# EasyEDA Pro project ProProject_Kame Quadrapot_2024-12-26.epro, schematic Upper_ESP32
Create Date: 2024-12-10; Page Name: P1; Project Name: Kame Quadrapot; Schematic Name: Upper_ESP32; Update Date: 2024-12-20; Company: Personal; Drawn: San Thit Aung; Page Size: A3; Part Number: PCB002; Reviewed: San Thit Aung; Version: V0.1
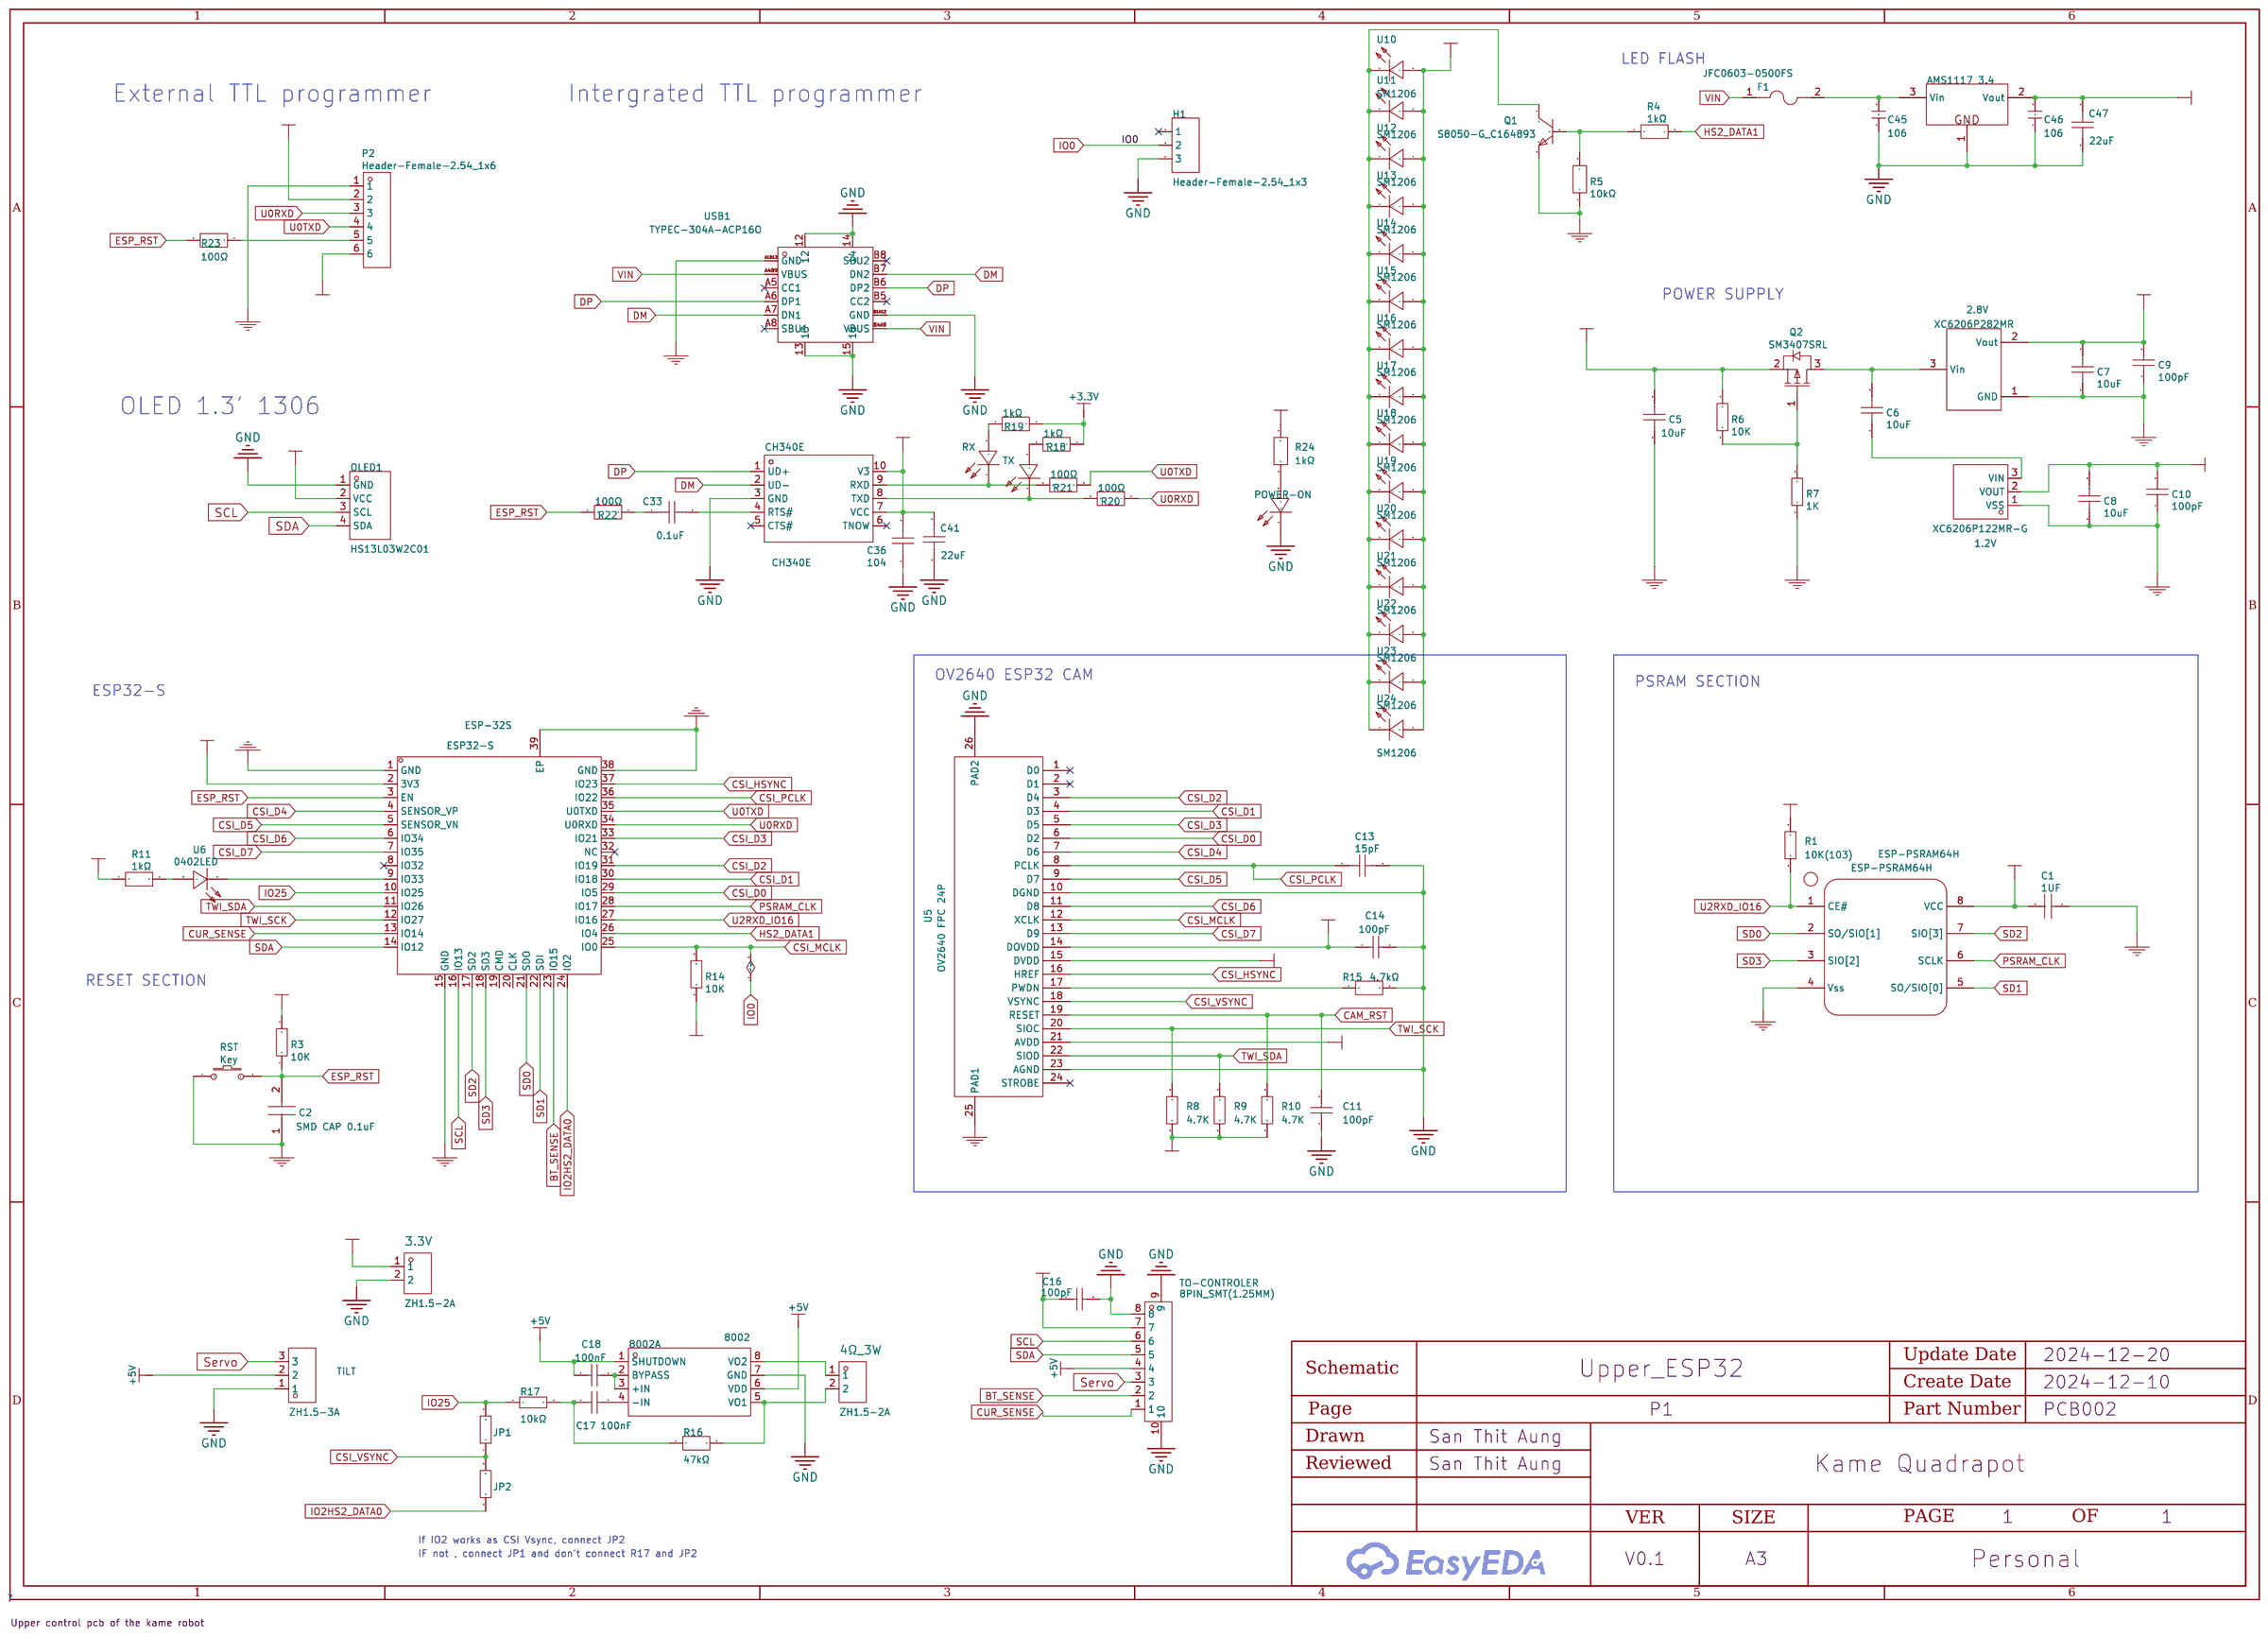
[diagram p0: schematic sheet]

## Parts
1.2V  XC6206P122MR-G  [SOT-23-3_L2.9-W1.6-P1.90-LS2.8-BR]
2.8V  XC6206P282MR  [SOT-23-3_L2.9-W1.6-P1.90-LS2.8-BR]
3.3V  ZH1.5-2A  [CONN-TH_ZH-1.5-2A]
4Ω_3W  ZH1.5-2A  [CONN-TH_ZH-1.5-2A]
8002A  8002  [SOP-8_L4.9-W3.9-P1.27-LS6.0-BL]
AMS1117 3.4  AMS1117-3.3  [TO-252-3_L6.6-W6.1-P4.58-LS10.1-BR]
C1  1UF  [0402]
C2  SMD CAP 0.1uF  [CAPC2012X94N]
C5  10uF  [C0805]
C6  10uF  [C0805]
C7  10uF  [C0805]
C8  10uF  [C0805]
C9  100pF  [C0402]
C10  100pF  [C0402]
C11  100pF  [C0402]
C13  15pF  [C0402]
C14  100pF  [C0402]
C16  100pF  [C0402]
C17  100nF  [C0603]
C18  100nF  [C0603]
C33  0.1uF  [C0603]
C36  104  [C0603]
C41  22uF  [C1206]
C45  106  [C0805]
C46  106  [C0805]
C47  22uF  [C1206]
CH340E  CH340E  [MSOP-10_L3.0-W3.0-P0.50-LS5.0-BL]
ESP-32S  ESP32-S  [WIRELM-SMD_ESP32-S-NO_CMD_CLK]
ESP-PSRAM64H  ESP-PSRAM64H  [SOP8_150MIL_JX]
F1  JFC0603-0500FS  [F0603]
H1  Header-Female-2.54_1x3  [HDR-3X1/2.54]
JP1  10kΩ  [R0603]
JP2  10kΩ  [R0603]
OLED1  HS13L03W2C01  [1.3'' 4pin oled SH1106]
P2  Header-Female-2.54_1x6  [HDR-TH_6P-P2.54-V-F]
POWER-ON  Green  [LED0603-RD_GREEN]
Q1  S8050-G_C164893  [SOT-23-3_L2.9-W1.3-P1.90-LS2.4-BR]
Q2  SM3407SRL  [SOT-23-3_L2.9-W1.3-P1.90-LS2.4-BR]
R1  10K(103)  [0603]
R3  10K  [0201]
R4  1kΩ  [R0402]
R5  10kΩ  [R0402]
R6  10K  [R0402]
R7  1K  [R0603]
R8  4.7K  [R0402]
R9  4.7K  [R0402]
R10  4.7K  [R0402]
R11  1kΩ  [R0402]
R14  10K  [R0402]
R15  4.7kΩ  [R0402]
R16  47kΩ  [R0603]
R17  10kΩ  [R0603]
R18  1kΩ  [R0603]
R19  1kΩ  [R0603]
R20  100Ω  [R0603]
R21  100Ω  [R0603]
R22  100Ω  [R0603]
R23  100Ω  [R0603]
R24  1kΩ  [R0603]
RST  Key  [KEY]
RX  Green  [LED0603-RD_GREEN]
TILT  ZH1.5-3A  [CONN-TH_ZH1.5-3A_C2829733]
TO-CONTROLER  8PIN_SMT(1.25MM)  [CONN-SMD_8PIN_SMT-P1.25]
TX  LedGreen_0603  [LED0603-RD_GREEN]
U5  OV2640 FPC 24P  [OV2640 FPC 24P]
U6  0402LED  [LED0402-RD]
U10  SM1206  [LED1206-RD]
U11  SM1206  [LED1206-RD]
U12  SM1206  [LED1206-RD]
U13  SM1206  [LED1206-RD]
U14  SM1206  [LED1206-RD]
U15  SM1206  [LED1206-RD]
U16  SM1206  [LED1206-RD]
U17  SM1206  [LED1206-RD]
U18  SM1206  [LED1206-RD]
U19  SM1206  [LED1206-RD]
U20  SM1206  [LED1206-RD]
U21  SM1206  [LED1206-RD]
U22  SM1206  [LED1206-RD]
U23  SM1206  [LED1206-RD]
U24  SM1206  [LED1206-RD]
USB1  TYPEC-304A-ACP16O  [USB-SMD_TYPEC-304A-ACP16O]

## Library data of the parts
1.2V = XC6206P122MR-G: Supplier: LCSC; Supplier Part: C424699; Manufacturer: Torex Semicon; JLCPCB Part Class: Extend; JLCPCB SMD: Yes; SMT Type: Extend; spicePre: U
2.8V = XC6206P282MR: Supplier: LCSC; Manufacturer: TOREX; image: //image.lceda.cn/szlcsc/C14255.jpg; Supplier Part: C14255; JLCPCB Part Class: Extend; JLCPCB SMD: Yes; SMT Type: Extend; spicePre: U
3.3V 4Ω_3W = ZH1.5-2A_C722910: Pins Structure:1x2P Pitch:1.5mm Mounting Style:Straight Reference Series:ZH Number of Pins:2P Number of Rows:1 Number of PINs Per Row:2 Row Spacing:- Current Rating (Max):1A Operating Temperature Range:-25℃~+85℃ Operating Temperature Range:-25℃~+85℃; LCSC Part Name: 1x2P 间距:1.5mm 直插 系列:ZH; Supplier Part: C722910; Manufacturer: CAX(创都); Supplier Footprint: 插件,P=1.5mm; JLCPCB Part Class: Extended Part; Datasheet: https://atta.szlcsc.com/upload/public/pdf/source/20200902/C722910_3A606E9023366FB4B71ACF538A145687.pdf; Supplier: LCSC; Pins Structure: 1x2P; Pitch: 1.5mm; Mounting Style: Straight; Reference Series: ZH; Number of Pins: 2P; Number of Rows: 1; Number of PINs Per Row: 2; Current Rating (Max): 1A; Operating Temperature Range: -25℃~+85℃
8002A = 8002: LCSC Part Name: Aip8002; Supplier Part: C5139016; Manufacturer: I-CORE(中微爱芯); Supplier Footprint: SOP-8; JLCPCB Part Class: Extended Part; Datasheet: https://atta.szlcsc.com/upload/public/pdf/source/20220816/03501F7F7652C9F9E3FDDA0D1837E9DD.pdf; Supplier: LCSC
AMS1117 3.4 = AMS1117-5.0: ------ѹоƬ; BOM____: --ѹоƬ; __Ȩ____: Դ----; ѧϰ__Դ: www.ooocke.com; Origin Footprint 2: SOT223_L; Origin Footprint 3: SOT223_M; Origin Footprint 4: SOT223_N; Origin Footprint 5: SOT89_N; Origin Footprint 6: SOT89_M; Origin Footprint 1: SOT89_L; Design Item ID: AMS1117; Library Name: 1.3   - --Դ--оƬ
C1 = 1UF: Partnumber: CL05A105MP5NNNC; Manufacturer: Samsung Electro-Mechanics; Comment: =Value; spicePre: C
C2 = SMD CAP 0.1uF: spicePre: C
C5-C8 = 10uF: Supplier: LCSC; Manufacturer: FH; Manufacturer Part: 0805F106M160NT; Supplier Part: C90545; JLCPCB Part Class: Extend; JLCPCB SMD: Yes; SMT Type: Extend; spicePre: C
C9-C11 C14 C16 = 100pF: Supplier: LCSC; Manufacturer: FH; Manufacturer Part: 0402CG101J500NT; Supplier Part: C1546; JLCPCB Part Class: Basic; JLCPCB SMD: Yes; SMT Type: Basic; spicePre: C
C13 = 15pF: Supplier: LCSC; Supplier Part: C3903890; Manufacturer: TDK; Manufacturer Part: CGJ2B2C0G1H150J050BA; spicePre: C
C17 C18 = CT41G-0603-2X1-50V-0.1μF-K(N): Capacitance: Tolerance:±10% Tolerance:±10% Voltage Rated: Temperature Coefficient:; LCSC Part Name: 100nF ±10% 50V; Supplier Part: C125205; Manufacturer: TORCH(火炬); Supplier Footprint: 0603; JLCPCB Part Class: Extended Part; Datasheet: https://atta.szlcsc.com/upload/public/pdf/source/20171225/C150708_15141883600121203188.pdf; Supplier: LCSC; Tolerance: ±10%
C33 C36 = 1u: Manufacturer Part: ?
C41 C47 = 22uF: Supplier: LCSC; Supplier Part: C141046; Manufacturer: KEMET; Manufacturer Part: C1210C106M4PAC7800; JLCPCB Part Class: Extended Part
C45 C46 = 106: -޼-----Ƭ----; BOM____: -޼-----Ƭ----; __Ȩ____: Դ----; ѧϰ__Դ: www.ooocke.com; Origin Footprint 2: C 0201_L; Origin Footprint 3: C 0402_L; Origin Footprint 4: C 0603_L; Origin Footprint 5: C 1206_L; Origin Footprint 6: C 1210_L; Origin Footprint 7: C 1808_L; Origin Footprint 8: C 1812_L; Origin Footprint 9: C 1825_L; Origin Footprint 10: C 2225_L; Origin Footprint 11: C 0201_M; Origin Footprint 12: C 0402_M; Origin Footprint 13: C 0603_M; Origin Footprint 14: C 0805_M; Origin Footprint 15: C 1206_M; Origin Footprint 16: C 1210_M; Origin Footprint 17: C 1808_M; Origin Footprint 18: C 1812_M; Origin Footprint 19: C 1825_M; Origin Footprint 20: C 2225_M; Origin Footprint 1: C 0805_L; Design Item ID: C; Library Name: 3.1   - -------------
CH340E = CH340E: Applications Function:Transceiver Protocol: Supply Voltage:3.3V；5V Supply Voltage:3.3V；5V Data Rate:2Mbps; LCSC Part Name: USB转串口芯片CH340; Supplier Part: C99652; Manufacturer: WCH(南京沁恒); Supplier Footprint: MSOP-10; JLCPCB Part Class: Extended Part; Datasheet: https://atta.szlcsc.com/upload/public/pdf/source/20240313/4FD4567B6A986AE079C4960D6CEBDDB5.pdf; Supplier: LCSC; Applications Function: Transceiver; Supply Voltage: 3.3V；5V; Data Rate: 2Mbps
ESP-32S = ESP32-S: Supplier: LCSC; Supplier Part: C277944; Manufacturer: Ai-Thinker; spicePre: U
ESP-PSRAM64H = ESP-PSRAM64H: Manufacturer: Espressif; Manufacturer Part: PSRAM64H; link: https://www.espressif.com/sites/default/files/documentation/esp-psram64_esp-psram64h_datasheet_en.pdf; spicePre: U
F1 = JFC0603-0500FS: Type:SMD Fuse Current Rating:500mA Voltage Rating  (AC):32V Voltage Rating (DC):32V Operating Temperature:-55℃~+125℃ Operating Temperature:-55℃~+125℃ Breaking Capacity:50A; LCSC Part Name: 贴片式保险丝; Supplier Part: C136327; Manufacturer: JDTfuse(集电通); Supplier Footprint: 0603; JLCPCB Part Class: Extended Part; Datasheet: https://atta.szlcsc.com/upload/public/pdf/source/20230515/811EFBDB78EA9425F730277E38B1B60D.pdf; Supplier: LCSC; Type: SMD Fuse; Current Rating: 500mA; Voltage Rating  (AC): 32V; Voltage Rating (DC): 32V; Operating Temperature: -55℃~+125℃; Breaking Capacity: 50A
H1 = Header-Female-2.54_1x3: Supplier Part: C50950; Supplier: LCSC; Manufacturer: BOOMELE; Manufacturer Part: 2.54mm 1*3p Female header
JP1 JP2 R17 = RMC060310KFN: Resistance: Tolerance:±1% Tolerance:±1% Power(Watts):; LCSC Part Name: 10kΩ ±1% 100mW; Supplier Part: C269701; Manufacturer: Tyohm(幸亚电阻); Supplier Footprint: 0603; JLCPCB Part Class: Extended Part; Datasheet: https://atta.szlcsc.com/upload/public/pdf/source/20190115/C325956_D27151D492FFB3C9AB4A6F14FE01F30A.pdf; Supplier: LCSC; Tolerance: ±1%
OLED1 = HS13L03W2C01: Main Control Chip:SH1106 Interface Type:I2C Size:1.3 Operating Temperature:-40℃~+70℃ Operating Temperature:-40℃~+70℃; LCSC Part Name: 1.3'1.3寸 128*64 OLED显示屏 I2C通讯 SH1106 白光; Supplier Part: C7465997; Manufacturer: HS(汉昇); JLCPCB Part Class: Extended Part; Datasheet: https://atta.szlcsc.com/upload/public/pdf/source/20230720/8731A47396DED074CDCD72E9ACEFB46F.pdf; Supplier: LCSC; Main Control Chip: SH1106; Interface Type: I2C; Size: 1.3; Operating Temperature: -40℃~+70℃
P2 = Header-Female-2.54_1x6: Supplier: LCSC; Manufacturer: BOOMELE(博穆精密); Manufacturer Part: 2.54-1*6P母; Supplier Part: C40877; JLCPCB Part Class: Extended Part; spicePre: P
POWER-ON RX TX = LedGreen_0603: Supplier: Mouser
Q1 = S8050-G_C164893: Supplier: LCSC; Supplier Part: C164893; Manufacturer: Changjiang Electronics Tech (CJ); Manufacturer Part: S8050-G; JLCPCB Part Class: Extend; JLCPCB SMD: Yes; SMT Type: Extend; spicePre: Q
Q2 = SM3407SRL: Supplier: LCSC; Supplier Part: C235545; Manufacturer: SPS; JLCPCB Part Class: Extend; JLCPCB SMD: Yes; SMT Type: Extend; spicePre: Q
R1 = 10K(103): Supplier Part: C99198; Supplier: LCSC; Manufacturer: YAGEO; Manufacturer Part: RC0603JR-0710KL; spicePre: R
R3 = 10K: Supplier: Digi-Key; Manufacturer: YAGEO; Manufacturer Part: RC0201JR-0710KL; Supplier Part: 311-10KNCT-ND; sourceId: Yke82kCUc; spicePre: R
R4 R11 = 1kΩ: Supplier: LCSC; Supplier Part: C2961360; Manufacturer: FH(风华); Manufacturer Part: TC02G1001FT; JLCPCB Part Class: Extended Part; spicePre: U
R5 = 10kΩ: Supplier: LCSC; Supplier Part: C5119777; Manufacturer: RALEC(旺诠); Manufacturer Part: RAT021002FTH; JLCPCB Part Class: Extended Part; spicePre: U
R6 R14 = 10K: Supplier: LCSC; Manufacturer: UniOhm; Manufacturer Part: 0402WGF1002TCE; Supplier Part: C25744; JLCPCB Part Class: Basic; JLCPCB SMD: Yes; SMT Type: Basic; spicePre: R
R7 = 1K: Supplier: LCSC; Manufacturer: UniOhm; Manufacturer Part: 0603WAF1001T5E; Supplier Part: C21190; JLCPCB Part Class: Basic; JLCPCB SMD: Yes; SMT Type: Basic; spicePre: R
R8-R10 = 4.7K: Supplier: LCSC; Manufacturer: UniOhm; Manufacturer Part: 0402WGF4701TCE; Supplier Part: C25900; JLCPCB Part Class: Basic; JLCPCB SMD: Yes; SMT Type: Basic; spicePre: R
R15 = 4.7kΩ: Supplier: LCSC; Supplier Part: C2906941; Manufacturer: FOJAN(富捷); Manufacturer Part: FRC0402J472 TS; JLCPCB Part Class: Extended Part; spicePre: U
R16 R18-R24 = SCR0603F8R06: Type:Thick Film Resistors Resistance: Tolerance:±1% Tolerance:±1% Power(Watts): Overload Voltage (Max): Operating Temperature Range:-55℃~+155℃ Operating Temperature Range:-55℃~+155℃; LCSC Part Name: 厚膜电阻 8.06Ω ±1% 100mW; Supplier Part: C3016465; Manufacturer: VO(翔胜); Supplier Footprint: 0603; JLCPCB Part Class: Extended Part; Datasheet: https://atta.szlcsc.com/upload/public/pdf/source/20220513/247AF9639BA21CF93567DC289CCC6A22.pdf; Supplier: LCSC; Type: Thick Film Resistors; Tolerance: ±1%; Operating Temperature Range: -55℃~+155℃
RST = Key: spicePre: U
TILT = ZH1.5-3A: Pins Structure:1x3P Pitch:1.5mm Mounting Style:Direct Insert Reference Series:ZH Number of Pins:3P Number of Rows:1 Number of PINs Per Row:3 Current Rating (Max):1A Contact Material:Brass Contact Plating:Tin Operating Temperature Range:-25℃~+85℃ Operating; LCSC Part Name: 1x3P 间距:1.5mm 直插 系列:ZH; Supplier Part: C2829733; Manufacturer: FG(富港); Supplier Footprint: 插件,P=1.5mm; JLCPCB Part Class: Extended Part; Datasheet: https://atta.szlcsc.com/upload/public/pdf/source/20210425/C2829732_F26530E371F6662D5811C22FF273BDDC.pdf; Supplier: LCSC; Pins Structure: 1x3P; Pitch: 1.5mm; Mounting Style: Direct Insert; Reference Series: ZH; Number of Pins: 3P; Number of Rows: 1; Number of PINs Per Row: 3; Current Rating (Max): 1A; Contact Material: Brass; Contact Plating: Tin; Operating Temperature Range: -25℃~+85℃; Rated Voltage (Max): 100V
TO-CONTROLER = 8PIN_SMT(1.25MM): Supplier Part: C9900003224; Supplier Footprint: CON-SMD-8PIN-P1.25mm; JLCPCB Part Class: Extended Part; Supplier: LCSC
U5 = OV2640 FPC 24P: Supplier: LCSC; spicePre: U
U6 = 0402LED: Supplier: LCSC; Supplier Part: C9900023982; Manufacturer: null; JLCPCB Part Class: Extended Part; spicePre: U
U10-U24 = SM1206: Supplier Part: C9900019107; Supplier Footprint: LED-SMD1206; JLCPCB Part Class: Extended Part; Supplier: LCSC
USB1 = TYPEC-304A-ACP16O: Supplier: LCSC; Supplier Part: C2909610; Manufacturer: XUNPU(讯普); JLCPCB Part Class: Extended Part

## Nets
+3.3V: 3.3V.1 AMS1117 3.4.2(Vout) C1.1 C5.2 C14.1 C16.1 C36.2 C41.2 C46.2 C47.2 CH340E.7(VCC) CH340E.10(V3) ESP-32S.2(3V3) ESP-PSRAM64H.8(VCC) OLED1.2(VCC) P2.6 Q2.2(S) R1.2 R3.2 R6.2 R8.1 R9.1 R10.1 R11.1 R14.1 R18.1 R19.1 R24.1 TO-CONTROLER.7 U5.14(DOVDD) U10.2(+) U11.2(+) U12.2(+) U13.2(+) U14.2(+) U15.2(+) U16.2(+) U17.2(+) U18.2(+) U19.2(+) U20.2(+) U21.2(+) U22.2(+) U23.2(+) U24.2(+)
+5V: 8002A.1(SHUTDOWN) 8002A.6(VDD) C18.1 P2.2 TILT.2 TO-CONTROLER.4
GND: 1.2V.1(VSS) 2.8V.1(GND) 3.3V.2 8002A.7(GND) AMS1117 3.4.1(GND) C1.2 C2.1 C5.1 C7.1 C8.1 C9.1 C10.1 C11.1 C13.2 C14.2 C16.2 C36.1 C41.1 C45.1 C46.1 C47.1 CH340E.3(GND) ESP-32S.1(GND) ESP-32S.15(GND) ESP-32S.38(GND) ESP-32S.39(EP) ESP-PSRAM64H.4(Vss) H1.3 OLED1.1(GND) P2.1 POWER-ON.1(K) Q1.2(E) R5.1 R7.1 R15.2 RST.1 TILT.1 TO-CONTROLER.8 TO-CONTROLER.9 TO-CONTROLER.10 U5.10(DGND) U5.23(AGND) U5.25(PAD1) U5.26(PAD2) USB1.12 USB1.13 USB1.14 USB1.15 USB1.A1B12(GND) USB1.B1A12(GND)
VIN: F1.1 USB1.A4B9(VBUS) USB1.B4A9(VBUS)
BT_SENSE: ESP-32S.23(IO15) TO-CONTROLER.2
CAM_RST: C11.2 R10.2 U5.19(RESET)
CSI_1.2V: 1.2V.2(VOUT) C8.2 C10.2 U5.15(DVDD)
CSI_2.8V: 2.8V.2(Vout) C7.2 C9.2 U5.21(AVDD)
CSI_D0: ESP-32S.29(IO5) U5.6(D2)
CSI_D1: ESP-32S.30(IO18) U5.4(D3)
CSI_D2: ESP-32S.31(IO19) U5.3(D4)
CSI_D3: ESP-32S.33(IO21) U5.5(D5)
CSI_D4: ESP-32S.4(SENSOR_VP) U5.7(D6)
CSI_D5: ESP-32S.5(SENSOR_VN) U5.9(D7)
CSI_D6: ESP-32S.6(IO34) U5.11(D8)
CSI_D7: ESP-32S.7(IO35) U5.13(D9)
CSI_HSYNC: ESP-32S.37(IO23) U5.16(HREF)
CSI_MCLK: ESP-32S.25(IO0) H1.2 R14.2 U5.12(XCLK)
CSI_PCLK: C13.1 ESP-32S.36(IO22) U5.8(PCLK)
CSI_VSYNC: JP1.1 JP2.2 U5.18(VSYNC)
CUR_SENSE: ESP-32S.13(IO14) TO-CONTROLER.1
DM: CH340E.2(UD-) USB1.A7(DN1) USB1.B7(DN2)
DP: CH340E.1(UD+) USB1.A6(DP1) USB1.B6(DP2)
ESP_RST: C2.2 ESP-32S.3(EN) R3.1 R22.2 R23.2 RST.2
HS2_DATA1: ESP-32S.26(IO4) R4.2
IO2HS2_DATA0: ESP-32S.24(IO2) JP2.1
IO25: ESP-32S.10(IO25) JP1.2 R17.1
PSRAM_CLK: ESP-32S.28(IO17) ESP-PSRAM64H.6(SCLK)
SCL: ESP-32S.16(IO13) OLED1.3(SCL) TO-CONTROLER.6
SD0: ESP-32S.21(SDO) ESP-PSRAM64H.2(SO/SIO[1])
SD1: ESP-32S.22(SDI) ESP-PSRAM64H.5(SO/SIO[0])
SD2: ESP-32S.17(SD2) ESP-PSRAM64H.7(SIO[3])
SD3: ESP-32S.18(SD3) ESP-PSRAM64H.3(SIO[2])
SDA: ESP-32S.14(IO12) OLED1.4(SDA) TO-CONTROLER.5
Servo: TILT.3 TO-CONTROLER.3
TWI_SCK: ESP-32S.12(IO27) R8.2 U5.20(SIOC)
TWI_SDA: ESP-32S.11(IO26) R9.2 U5.22(SIOD)
U0RXD: ESP-32S.34(U0RXD) P2.3 R20.1
U0TXD: ESP-32S.35(U0TXD) P2.4 R21.1
U2RXD_IO16: ESP-32S.27(IO16) ESP-PSRAM64H.1(CE#) R1.1
$1N1366: Q1.1(B) R4.1 R5.2
$1N1371: Q2.1(G) R6.1 R7.2
$1N1376: 1.2V.3(VIN) C6.1
$1N1377: 2.8V.3(Vin) C6.2 Q2.3(D)
$1N1387: R11.2 U6.2(+)
$1N2699: R15.1 U5.17(PWDN)
$1N3848: ESP-32S.9(IO33) U6.1(-)
$1N6631: 8002A.4(-IN) C17.2
$1N6705: 8002A.2(BYPASS) 8002A.3(+IN) C18.2
$1N6802: 4Ω_3W.1 8002A.8(VO2)
$1N6814: 4Ω_3W.2 8002A.5(VO1) R16.2
$1N6899: C17.1 R16.1 R17.2
$1N8468: R19.2 RX.2(A)
$1N8470: R18.2 TX.2(A)
$1N8560: CH340E.8(TXD) R20.2 TX.1(K)
$1N8606: CH340E.9(RXD) R21.2 RX.1(K)
$1N8778: P2.5 R23.1
$1N8842: C33.2 CH340E.4(RTS#)
$1N8845: C33.1 R22.1
$1N9016: POWER-ON.2(A) R24.2
$1N9952: Q1.3(C) U10.1(-) U11.1(-) U12.1(-) U13.1(-) U14.1(-) U15.1(-) U16.1(-) U17.1(-) U18.1(-) U19.1(-) U20.1(-) U21.1(-) U22.1(-) U23.1(-) U24.1(-)
$1N12496: AMS1117 3.4.3(Vin) C45.2 F1.2

Not connected (* = marked no-connect by the designer): CH340E 5(CTS#)* 6(TNOW)*; ESP-32S 8(IO32)* 19(CMD) 20(CLK) 32(NC)*; H1 1*; U5 1(D0)* 2(D1)* 24(STROBE)*; USB1 A5(CC1)* A8(SBU1)* B5(CC2)* B8(SBU2)*

## Notes on the sheet
- LED FLASH
- External TTL programmer
- Intergrated TTL programmer
- POWER SUPPLY
- OLED 1.3' 1306
- OV2640 ESP32 CAM
- PSRAM SECTION
- ESP32-S
- RESET SECTION
- If IO2 works as CSI Vsync, connect JP2
- IF not , connect JP1 and don't connect R17 and JP2
